# EAGLE design controller schematic (EAGLE 9.6.2)
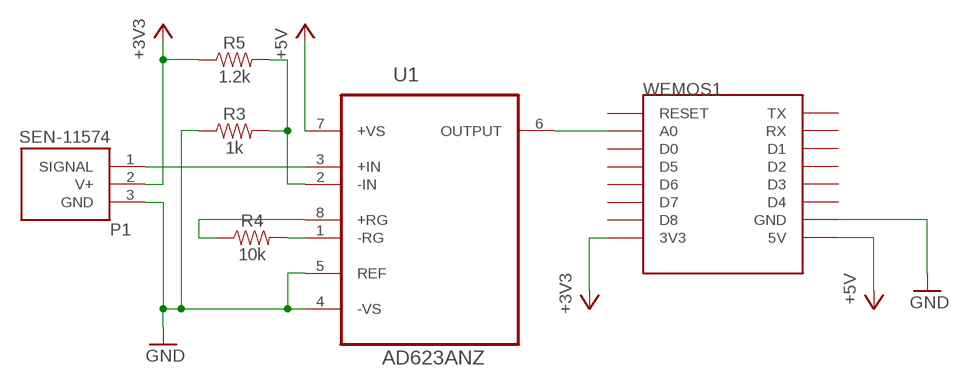
[diagram p0: schematic, sheet 1]

## Parts
P1  SEN-11574  [XDCR_SEN-11574]
R3  1k  1KOHM-HORIZ-1/4W-5%  [AXIAL-0.3]
R4  10k  10KOHM-HORIZ-1/4W-1%  [AXIAL-0.3]
R5  1.2k  1KOHM-HORIZ-1/4W-1%  [AXIAL-0.3]
U1  AD623ANZ  [DIP254P762X533-8]
WEMOS1  WEMOS-D1-MINI  [WEMOS-D1-MINI]

## Nets
+3V3: P1.2(V+) R5.P$1 WEMOS1.3V3
+5V: U1.7(+VS) WEMOS1.5V
GND: P1.3(GND) R3.P$1 U1.4(-VS) U1.5(REF) WEMOS1.GND
N$1: P1.1(SIGNAL) U1.3(+IN)
N$2: U1.6(OUTPUT) WEMOS1.A0
N$3: R4.P$2 U1.1(-RG)
N$4: R4.P$1 U1.8(+RG)
N$5: R3.P$2 R5.P$2 U1.2(-IN)
Unconnected: WEMOS1.D0 WEMOS1.D1 WEMOS1.D2 WEMOS1.D3 WEMOS1.D4 WEMOS1.D5 WEMOS1.D6 WEMOS1.D7 WEMOS1.D8 WEMOS1.RESET WEMOS1.RX WEMOS1.TX

## Library data of the parts
P1 = SEN-11574:SEN-11574: Pulse Sensor For Arduino Check availability <https://pricing.snapeda.com/parts/SEN-11574/SparkFun/view-part?ref=eda>; AVAILABILITY: In Stock; DESCRIPTION: PULSE SENSOR FOR ARDUINO; MF: SparkFun; MP: SEN-11574; PACKAGE: None; PRICE: None; PURCHASE-URL: https://pricing.snapeda.com/search/part/SEN-11574/?ref=eda
R3 = SparkFun-Resistors:1KOHM: 1kΩ resistor A resistor is a passive two-terminal electrical component that implements electrical resistance as a circuit element. Resistors act to reduce current flow, and, at the same time, act to lower voltage levels within circuits. - Wikipedia; PROD_ID: RES-08380
R4 = SparkFun-Resistors:10KOHM: 10kΩ resistor A resistor is a passive two-terminal electrical component that implements electrical resistance as a circuit element. Resistors act to reduce current flow, and, at the same time, act to lower voltage levels within circuits. - Wikipedia; PROD_ID: RES-12183
R5 = SparkFun-Resistors:1KOHM: 1kΩ resistor A resistor is a passive two-terminal electrical component that implements electrical resistance as a circuit element. Resistors act to reduce current flow, and, at the same time, act to lower voltage levels within circuits. - Wikipedia; PROD_ID: RES-12182; VALUE: 1k
U1 = AD623ANZ:AD623ANZ: Single-Supply, Rail-to-Rail, Low Cost Instrumentation Amplifier Check availability <https://pricing.snapeda.com/parts/AD623ANZ/Analog%20Devices/view-part?ref=eda>; AVAILABILITY: In Stock; DESCRIPTION: Instrumentation Amplifier 1 Circuit Rail-to-Rail 8-PDIP; MF: Analog Devices; MP: AD623ANZ; PACKAGE: PDIP-8 Analog Devices; PRICE: None; PURCHASE-URL: https://pricing.snapeda.com/search/part/AD623ANZ/?ref=eda; SPICEPREFIX: X
WEMOS1 = esp8266modules:WEMOS-D1-MINI: WeMos.cc D1 mini ESP8266 module

## Board
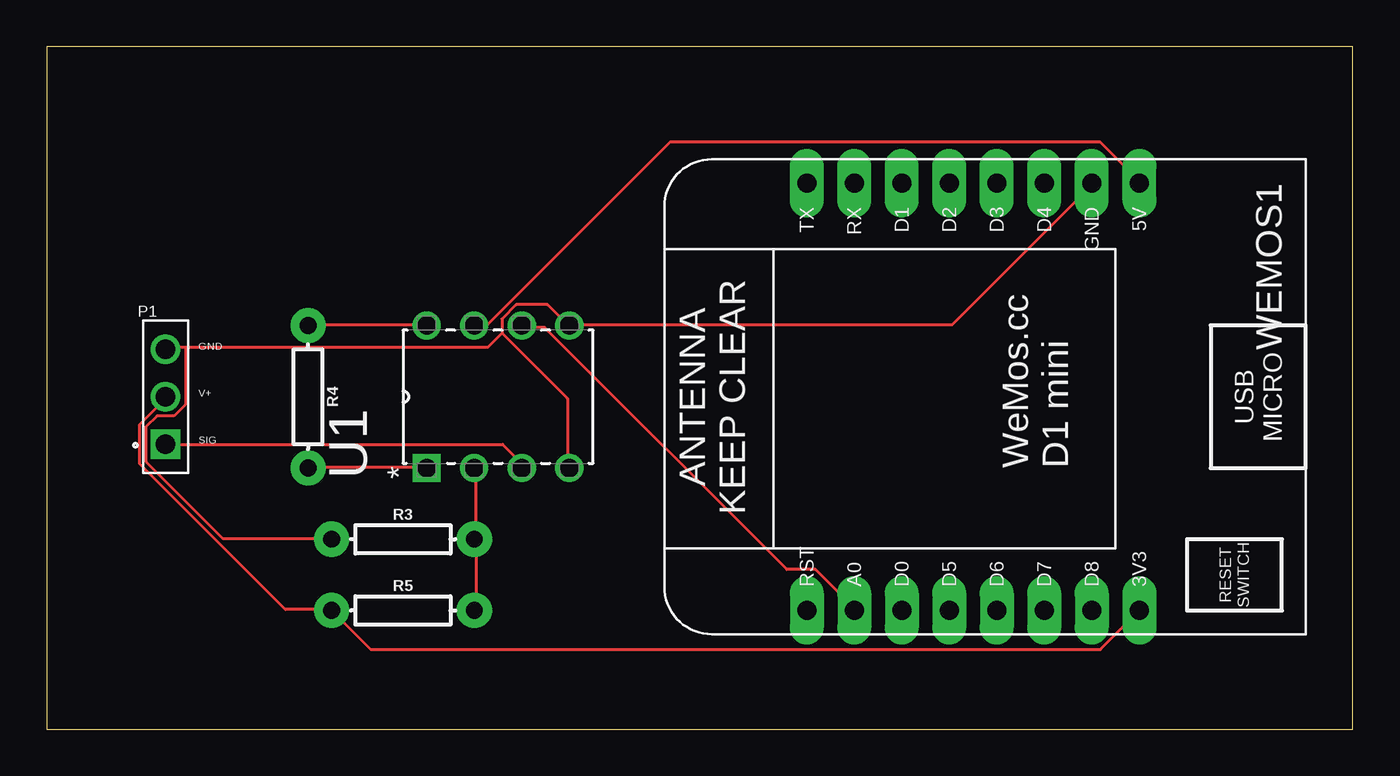
[diagram p1: board, top side]

Size 69.83 x 36.5 mm. Coordinates in mm from the lower left corner, seen from the top.
Outline: 0,0 69.83,0 69.83,36.5 0,36.5 0,0
Copper layers (1*16): Top 0.035mm / dielectric 1.5mm / Bottom 0.035mm
Design rules "default": minimum track width 6mil, minimum drill 0.35mm, track to track 6mil, track to pad 6mil, pad to pad 6mil, via to via 6mil, smd to smd 6mil, copper to edge 40mil, drill to drill 6mil, minimum pad ring 10mil, minimum via ring 8mil, stop-mask expansion 4mil, vias tented up to drill 0mil, thermal gap 10mil

### Footprints (pad centres in the part's own frame; a part is rotated, then mirrored left to right if it is on the bottom)
XDCR_SEN-11574 = drill 1.04 square: 1 0,-2.54 | drill 1.04: 2 0,0; 3 0,2.54
AXIAL-0.3 = drill 0.9 pad 1.88: P$1 -3.81,0; P$2 3.81,0
DIP254P762X533-8 = drill 0.991 square: 1 -7.62,7.62 | drill 0.991: 2 -7.62,5.08; 3 -7.62,2.54; 4 -7.62,0; 5 0,0; 6 0,2.54; 7 0,5.08; 8 0,7.62
WEMOS-D1-MINI = drill 1.016 pad 1.829 long: 3V3 -10.16,-10.16; 5V 12.7,-10.16; A0 -10.16,5.08; D0 -10.16,2.54; D1 12.7,2.54; D2 12.7,0; D3 12.7,-2.54; D4 12.7,-5.08; D5 -10.16,0; D6 -10.16,-2.54; D7 -10.16,-5.08; D8 -10.16,-7.62; GND 12.7,-7.62; RESET -10.16,7.62; RX 12.7,5.08; TX 12.7,7.62

### Placement (x,y rotation side)
P1  6.35,17.78 0 top
R3  19.05,10.16 0 top
R4  13.97,17.78 270 top
R5  19.05,6.35 0 top
U1  27.94,21.59 90 top
WEMOS1  48.26,16.51 90 top

### Tracks (layer width: path | path; a pad name or v marks a point on that pad's centre or on a via)
+3V3
  Top 0.152: P1.2 6.35,17.68 4.98,16.31 4.98,14.17 12.75,6.4 15.19,6.4 R5.P$1 17.32,4.27 56.34,4.27 WEMOS1.3V3
+5V
  Top 0.152: U1.7 22.96,21.64 23.57,21.64 33.33,31.39 56.34,31.39 58.47,29.26 WEMOS1.5V
GND
  Top 0.152: 24.33,21.18 27.84,17.68 27.84,14.02 U1.4 | 24.33,21.18 24.33,21.95 25.09,22.71 26.77,22.71 27.84,21.64 U1.5 27.99,21.64 48.41,21.64 55.88,29.11 WEMOS1.GND | 7.42,20.42 23.57,20.42 24.33,21.18 | 7.42,20.42 6.35,20.42 P1.3 | 7.42,20.42 7.42,17.37 6.81,16.76 5.89,16.76 5.28,16.15 5.28,14.33 9.4,10.21 15.19,10.21 R3.P$1
N$1
  Top 0.152: U1.3 25.4,14.22 24.38,15.24 P1.1
N$2
  Top 0.152: U1.6 25.4,21.49 26.62,21.49 39.57,8.53 41.1,8.53 43.23,6.4 WEMOS1.A0
N$3
  Top 0.152: U1.1 20.22,14.02 13.97,14.02 R4.P$2
N$4
  Top 0.152: U1.8 20.22,21.64 13.97,21.64 R4.P$1
N$5
  Top 0.152: U1.2 22.96,13.87 22.96,10.21 R3.P$2 22.96,10.06 22.96,6.4 R5.P$2